# Altium schematic sheet 28Pins Schematic.SchDoc: 28Pins (part 2 of 3)
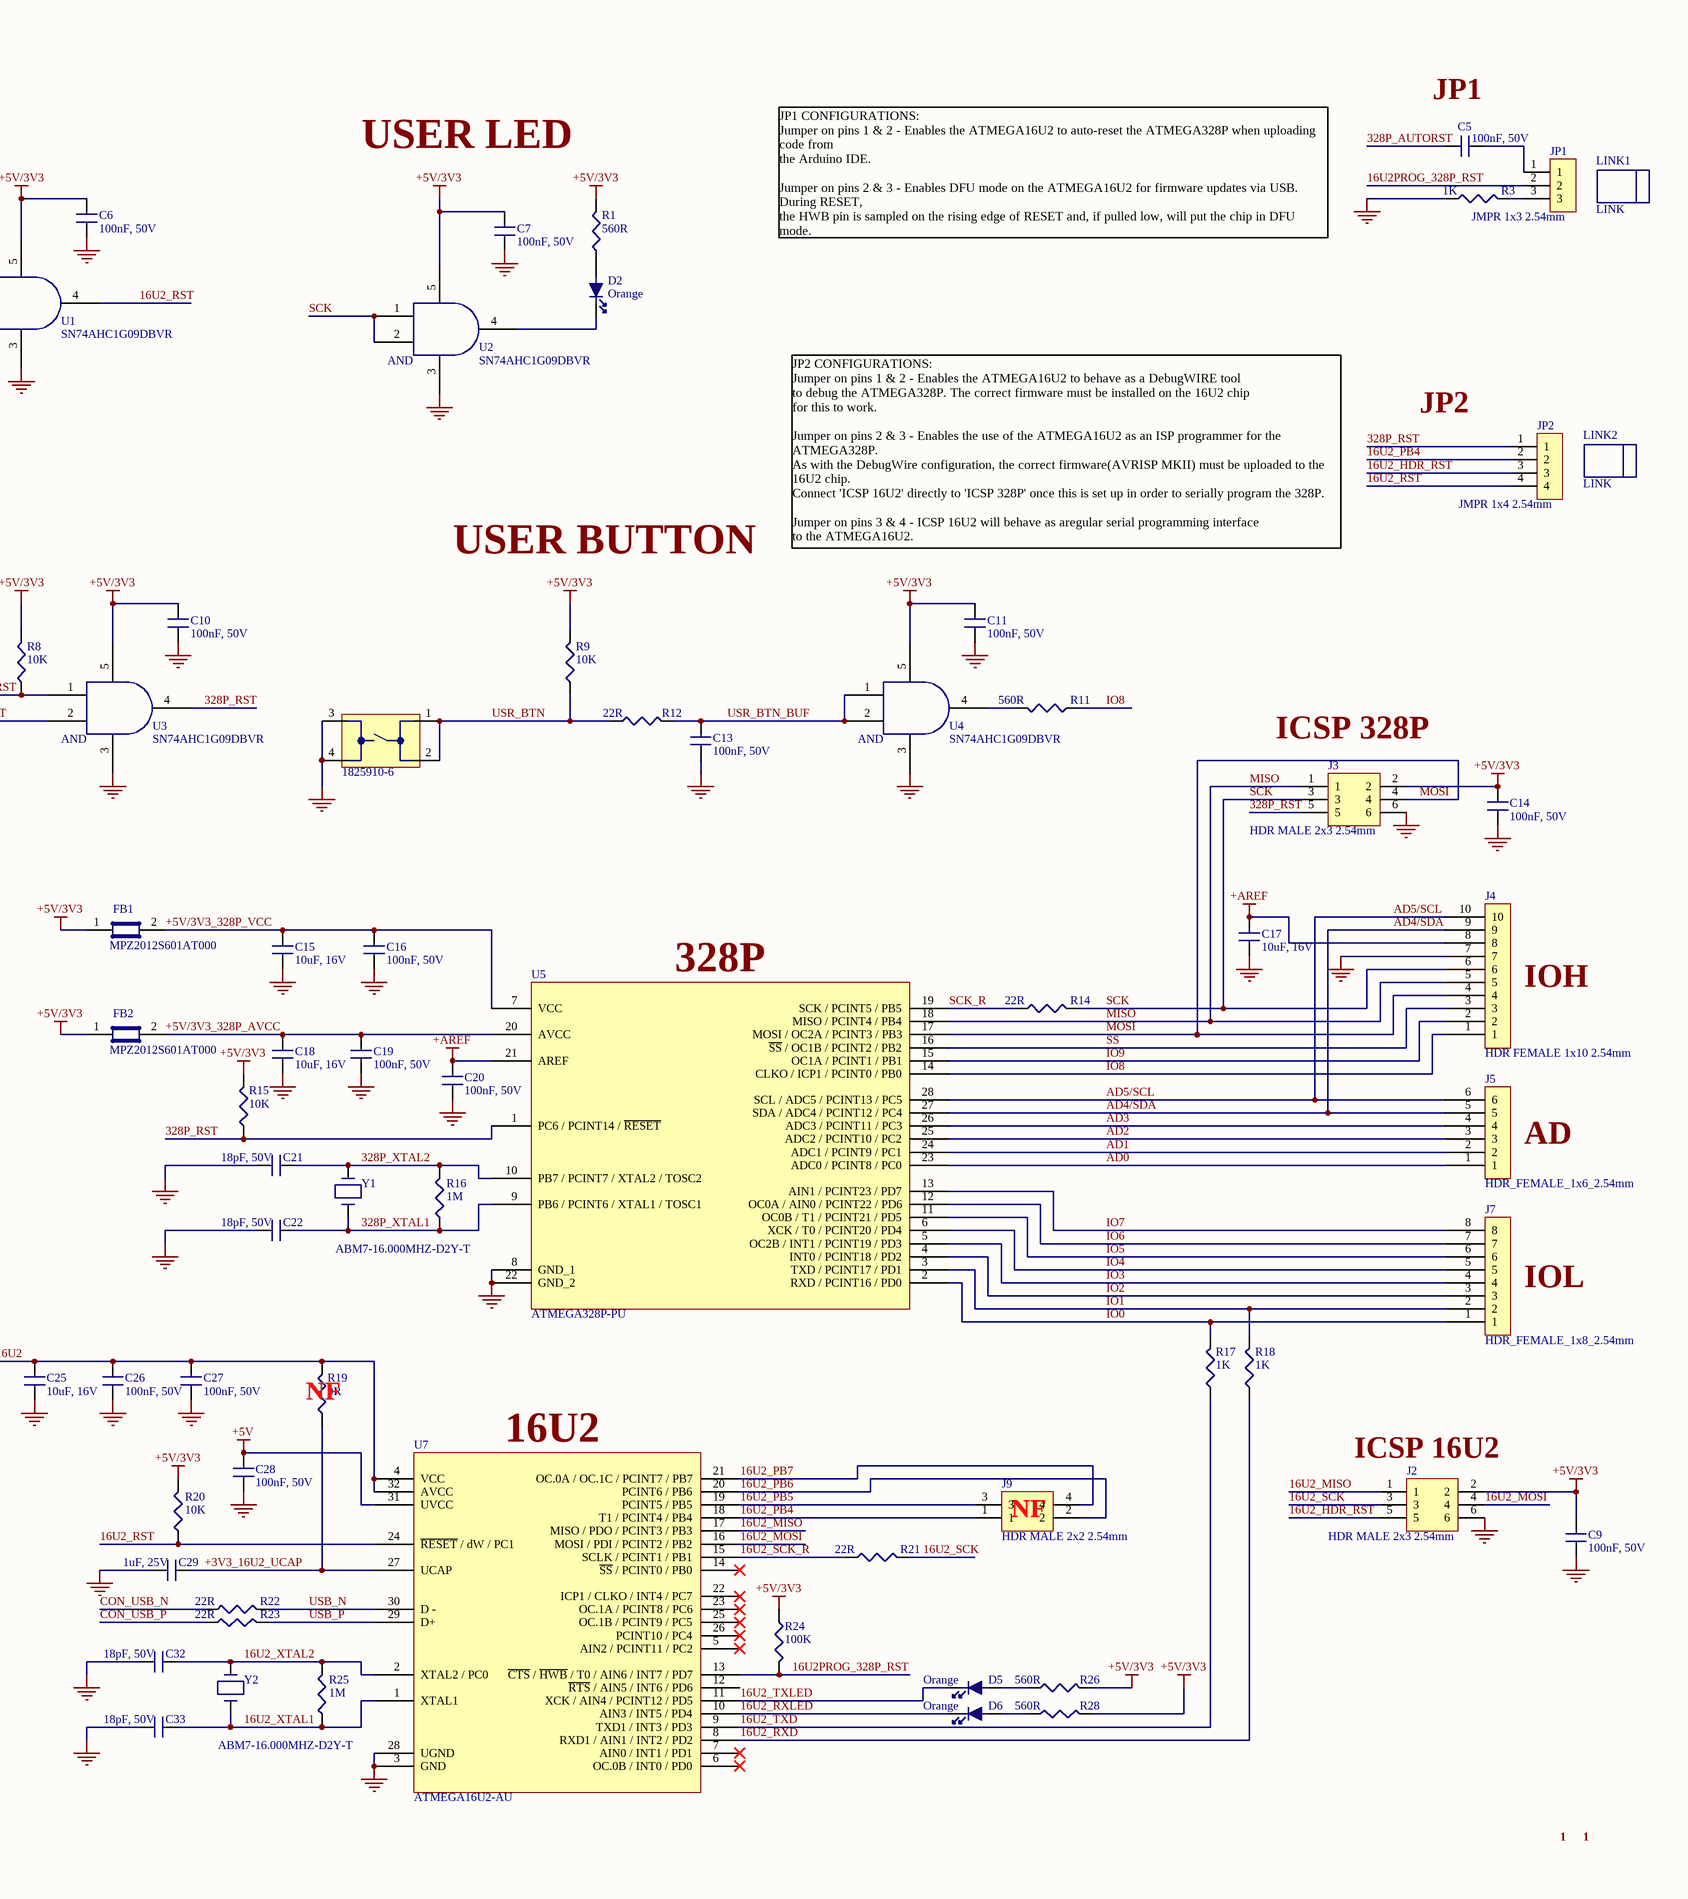
[diagram p2: 28Pins Schematic.SchDoc, right]
## Library data of the parts
C1-C3 C5-C14 C16 C19 C20 C26-C28 = C2012X7R1H104K085AA: TDK - C2012X7R1H104K085AA - Keramikvielschichtkondensator, SMD, 0.1 µF, 50 V, 0805 [Metrisch 2012], ± 10%, X7R, C Series TDK; PCN Part Number: MLCC Part Number Change 30/Nov/2012; Product Training Modules: C Series General Applications SEAT, CCV, and TVCL Design Tools Guide to Replacing an Electrolytic Capacitor with an MLCC; Capacitance: 0.1µF; Online Catalog: C Series, General Purpose; Kits: 445-9015-KIT-ND  - KIT MLCC 1000PF-47UF 0805 10-50V; Other Names: 445-7534-1; Supplier 1: Digi-Key; Manufacturer: TDK; Manufacturer Part Number: C2012X7R1H104K085AA; Stock 1: 148807; Pricing 1: 1=0.17, 10=0.119, 100=0.0561, 500=0.0394, 1000=0.0326 (USD); RoHS Information: RoHS Certificate-MLCC; Standard Package: 1; Category: Capacitors; Family: Ceramic Capacitors; Series: C; Packaging: Cut Tape (CT); Tolerance: ±10%; Voltage - Rated: 50V; Temperature Coefficient: X7R; Mounting Type: Surface Mount, MLCC; Operating Temperature: -55°C ~ 125°C; Applications: General Purpose; Ratings: -; Package / Case: 0805 (2012 Metric); Size / Dimension: 0.079" L x 0.049" W (2.00mm x 1.25mm); Height - Seated (Max): -; Thickness (Max): 0.037" (0.95mm); Lead Spacing: -; Features: -; Lead Style: -; ComponentLink1URL: http://uk.rs-online.com/webdocs/1532/0900766b81532cd0.pdf?src-supplier=RSComponents; ComponentLink1Description: http://uk.rs-online.com/webdocs/1532/0900766b81532cd0.pdf?src-supplier=RSComponents; ComponentLink2URL: https://product.tdk.com/info/en/catalog/datasheets/mlcc_commercial_general_en.pdf?src-supplier=Digi-Key; ComponentLink2Description: https://product.tdk.com/info/en/catalog/datasheets/mlcc_commercial_general_en.pdf?src-supplier=Digi-Key; ComponentLink3URL: http://www.tdk.co.jp/tefe02/e412_c.pdf?src-supplier=Future+Electronics; ComponentLink3Description: http://www.tdk.co.jp/tefe02/e412_c.pdf?src-supplier=Future+Electronics; ComponentLink4URL: http://www.farnell.com/datasheets/1796654.pdf?src-supplier=Newark; ComponentLink4Description: http://www.farnell.com/datasheets/1796654.pdf?src-supplier=Newark; ComponentLink5URL: http://www.farnell.com/datasheets/1571323.pdf?src-supplier=Element14; ComponentLink5Description: http://www.farnell.com/datasheets/1571323.pdf?src-supplier=Element14; Supplier Part Number 1: 445-7534-1-ND
C4 C15 C17 C18 C23-C25 = CGA4J1X5R1C106M125AC: Automotive Grade MLCC, 0805, X5R, 16V, 10 F, 20%, 1.25mm; Manufacturer: TDK; PCN Part Number: MLCC Part Number Change 30/Nov/2012; Product Training Modules: CGA Series for Automotive Applications SEAT, CCV, and TVCL Design Tools Guide to Replacing an Electrolytic Capacitor with an MLCC; Featured Product: CGA Series MLCC Capacitors; EDA / CAD Models: Download from Accelerated Designs; Capacitance: 10µF; Online Catalog: CGA Series, Automotive General, Mid and High Voltage; Other Names: 445-12654-1; Supplier 1: Digi-Key; Manufacturer Part Number: CGA4J1X5R1C106M125AC; Stock 1: 6740; Pricing 1: 1=0.52, 10=0.362, 100=0.2174, 500=0.163, 1000=0.1377 (USD); RoHS Information: CGA Series, RoHS Cert of Compliance; Standard Package: 1; Category: Capacitors; Family: Ceramic Capacitors; Series: CGA; Packaging: Cut Tape (CT); Tolerance: ±20%; Voltage - Rated: 16V; Temperature Coefficient: X5R; Mounting Type: Surface Mount, MLCC; Operating Temperature: -55°C ~ 85°C; Applications: Automotive; Ratings: AEC-Q200; Package / Case: 0805 (2012 Metric); Size / Dimension: 0.079" L x 0.049" W (2.00mm x 1.25mm); Thickness (Max): 0.057" (1.45mm); ComponentLink1URL: https://product.tdk.com/info/en/catalog/datasheets/mlcc_automotive_general_en.pdf?src-supplier=Digi-Key; ComponentLink1Description: https://product.tdk.com/info/en/catalog/datasheets/mlcc_automotive_general_en.pdf?src-supplier=Digi-Key; ComponentLink2URL: https://product.tdk.com/info/en/documents/chara_sheet/CGA4J1X5R1C106M125AC.pdf?src-supplier=Digi-Key; ComponentLink2Description: https://product.tdk.com/info/en/documents/chara_sheet/CGA4J1X5R1C106M125AC.pdf?src-supplier=Digi-Key; ComponentLink3URL: http://product.tdk.com/capacitor/mlcc/detailed_information.php?lang=en&ref=jp&part_no=CGA4J1X5R1C106M125AC&src-supplier=Mouser; ComponentLink3Description: http://product.tdk.com/capacitor/mlcc/detailed_information.php?lang=en&ref=jp&part_no=CGA4J1X5R1C106M125AC&src-supplier=Mouser; ComponentLink4URL: http://product.tdk.com/en/catalog/datasheets/mlcc_automotive_general_en.pdf?src-supplier=Avnet; ComponentLink4Description: http://product.tdk.com/en/catalog/datasheets/mlcc_automotive_general_en.pdf?src-supplier=Avnet; Supplier Part Number 1: 445-12654-1-ND
C21 C22 C32 C33 = C0805C180J5GACTU: CAP CER 18PF 50V C0G/NP0 0805; Manufacturer: KEMET; Product Depth: 1.25 mm; Product Height: 0.78 mm; Product Length: 2 mm; Dielectric: C0G; Tolerance: 5 %; Voltage: 50 Vdc; Supplier 1: Digi-Key; Manufacturer Part Number: C0805C180J5GACTU; Stock 1: 16285; Pricing 1: 1=0.14, 10=0.1, 100=0.0468, 500=0.0328, 1000=0.0272 (USD); Category: Capacitor Ceramic Multilayer; Construction: Flat; Operating Temperature: -55 to 125 °C; Capacitance Value: 18 pF; Mounting: Surface Mount; Package/Case: 0805; ComponentLink1URL: http://www.farnell.com/datasheets/1769375.pdf?src-supplier=Element14; ComponentLink1Description: http://www.farnell.com/datasheets/1769375.pdf?src-supplier=Element14; ComponentLink2URL: https://www.verical.com/server-webapp/html/getDatasheet?partID=385668&src-supplier=Verical; ComponentLink2Description: https://www.verical.com/server-webapp/html/getDatasheet?partID=385668&src-supplier=Verical; ComponentLink3URL: https://www.verical.com/server-webapp/html/getDatasheet?partID=759702&src-supplier=Verical; ComponentLink3Description: https://www.verical.com/server-webapp/html/getDatasheet?partID=759702&src-supplier=Verical; Supplier Part Number 1: 399-1112-1-ND
C29 = CGA4J3X7R1E105K125AB: CAP CER 1UF 25V X7R 0805; Manufacturer: TDK; PCN Part Number: MLCC Part Number Change 30/Nov/2012; Product Training Modules: CGA Series for Automotive Applications SEAT, CCV, and TVCL Design Tools Guide to Replacing an Electrolytic Capacitor with an MLCC; Featured Product: CGA Series MLCC Capacitors; Capacitance: 1µF; Tolerance: ±10%; Online Catalog: CGA Series, Automotive General, Mid and High Voltage; Other Names: 445-5687-6; Supplier 1: Digi-Key; Manufacturer Part Number: CGA4J3X7R1E105K125AB; Stock 1: 9208; Pricing 1: 1=0.24, 10=0.163, 100=0.0826, 500=0.0565, 1000=0.05 (USD); RoHS Information: RoHS Certificate-MLCC; Standard Package: 1; Category: Capacitors; Family: Ceramic Capacitors; Series: CGA; Packaging: Digi-Reel®; Voltage - Rated: 25V; Temperature Coefficient: X7R; Mounting Type: Surface Mount, MLCC; Operating Temperature: -55°C ~ 125°C; Applications: Automotive; Ratings: AEC-Q200; Package / Case: 0805 (2012 Metric); Size / Dimension: 0.079" L x 0.049" W (2.00mm x 1.25mm); Height - Seated (Max): -; Thickness (Max): 0.057" (1.45mm); Lead Spacing: -; Features: -; Lead Style: -; ComponentLink1URL: http://www.mouser.com/ds/2/400/lcc_automotive_general_en-843974.pdf?src-supplier=Mouser; ComponentLink1Description: http://www.mouser.com/ds/2/400/lcc_automotive_general_en-843974.pdf?src-supplier=Mouser; Supplier Part Number 1: 445-5687-1-ND
C30 C31 = EEE-1AA101WR: Cap Aluminum 100uF 10V 20% (5 X 5.4mm) SMD 50mA 1000 hr 85°C T/R; Manufacturer: Panasonic; Capacitance: 100 µF; Lifetime@Temperature: 2000 Hrs @ 85°C; Type: Can; Supplier 1: Digi-Key; Manufacturer Part Number: EEE-1AA101WR; Stock 1: 100201; Pricing 1: 1=0.32, 10=0.221, 100=0.1328, 500=0.0996 (USD); Case Size/Dimension: Ø 5 x 5.4 mm; Rated Voltage: 10 V; Operating Temp-Max: 85 °C; Operating Temp Range: -40 to +85 °C; Series: S; Ripple Current: 50 mA; ComponentLink1URL: https://industrial.panasonic.com/cdbs/www-data/pdf/RDE0000/DME0000COL90.pdf?src-supplier=Avnet; ComponentLink1Description: https://industrial.panasonic.com/cdbs/www-data/pdf/RDE0000/DME0000COL90.pdf?src-supplier=Avnet; ComponentLink2URL: https://industrial.panasonic.com/cdbs/www-data/pdf/RDE0000/DME0000COL90.pdf?src-supplier=Mouser; ComponentLink2Description: https://industrial.panasonic.com/cdbs/www-data/pdf/RDE0000/DME0000COL90.pdf?src-supplier=Mouser; ComponentLink3URL: http://industrial.panasonic.com/www-data/pdf/ABA0000/ABA0000CE2.pdf?src-supplier=Future+Electronics; ComponentLink3Description: http://industrial.panasonic.com/www-data/pdf/ABA0000/ABA0000CE2.pdf?src-supplier=Future+Electronics; ComponentLink4URL: https://industrial.panasonic.com/cdbs/www-data/pdf/RDE0000/DME0000COL90.pdf?src-supplier=Allied+Electronics; ComponentLink4Description: https://industrial.panasonic.com/cdbs/www-data/pdf/RDE0000/DME0000COL90.pdf?src-supplier=Allied+Electronics; ComponentLink5URL: https://industrial.panasonic.com/cdbs/www-data/pdf/RDE0000/DME0000COL90.pdf?src-supplier=Verical; ComponentLink5Description: https://industrial.panasonic.com/cdbs/www-data/pdf/RDE0000/DME0000COL90.pdf?src-supplier=Verical; Supplier Part Number 1: PCE3867CT-ND
D1 D3 = NSVBAT54HT1G: Schottky Diodes & Rectifiers SS SCHOTTKY DIODE; Manufacturer: ON Semiconductor; Voltage - DC Reverse (Vr) (Max): 30V; Current - Average Rectified (Io): 200mA (DC); Voltage - Forward (Vf) (Max) @ If: 800mV @ 100mA; Speed: Small Signal =; Reverse Recovery Time (trr): 5ns; Current - Reverse Leakage @ Vr: 2µA @ 25V; Capacitance @ Vr, F: 10pF @ 1V, 1MHz; Supplier 1: Digi-Key; Manufacturer Part Number: NSVBAT54HT1G; Stock 1: 10770; Pricing 1: 1=0.48, 10=0.362, 25=0.3268, 100=0.1723, 250=0.1705, 500=0.1527, 1000=0.1188 (USD); Standard Package: 3,000; Category: Discrete Semiconductor Products; Family: Diodes, Rectifiers - Single; Diode Type: Schottky; Mounting Type: Surface Mount; Package / Case: SC-76, SOD-323; Supplier Device Package: SOD-323; Packaging: Tape & Reel (TR); ComponentLink1URL: http://www.onsemi.com/pub/Collateral/BAT54HT1-D.PDF?src-supplier=Digi-Key; ComponentLink1Description: http://www.onsemi.com/pub/Collateral/BAT54HT1-D.PDF?src-supplier=Digi-Key; ComponentLink2URL: http://www.onsemi.com/pub_link/Collateral/BAT54HT1-D.PDF?src-supplier=Avnet+Europe; ComponentLink2Description: http://www.onsemi.com/pub_link/Collateral/BAT54HT1-D.PDF?src-supplier=Avnet+Europe; Supplier Part Number 1: NSVBAT54HT1GOSCT-ND
D2 D5 D6 = LOL29K-H2K1-24-Z: OSRAM - LO L29K-H2K1-24-Z - SMARTLED 0603 ORANGE; Manufacturer: Osram Opto; Categories: Optoelectronics; Configuration: Standard; Lens Color: White; Lens Transparency: Diffused; Millicandela Rating: 6.3mcd; Lens Style: Rectangle with Flat Top; Lens Size: 1.30mm x 0.80mm; Voltage - Forward (Vf) (Typ): 1.8V; Current - Test: 2mA; Viewing Angle: 160°; Wavelength - Dominant: 606nm; Wavelength - Peak: 610nm; Supplier 1: Digi-Key; Manufacturer Part Number: LOL29K-H2K1-24-Z; Stock 1: 0; Series: SmartLED; Packaging: Digi-Reel®; Part Status: Active; Color: Orange; Mounting Type: Surface Mount; Features: -; Package / Case: 0603 (1608 Metric); Supplier Device Package: 0603; Size / Dimension: 1.70mm L x 0.80mm W; Height (Max): 0.65mm; ComponentLink1URL: https://dammedia.osram.info/media/resource/hires/osram-dam-2493882/LO%20L29K.pdf?src-supplier=Digi-Key; ComponentLink1Description: https://dammedia.osram.info/media/resource/hires/osram-dam-2493882/LO%20L29K.pdf?src-supplier=Digi-Key; ComponentLink2URL: https://www.verical.com/server-webapp/html/getDatasheet?partID=693885&src-supplier=Verical; ComponentLink2Description: https://www.verical.com/server-webapp/html/getDatasheet?partID=693885&src-supplier=Verical; Supplier Part Number 1: 475-2740-2-ND
D4 = LGL29K-F2J1-24-Z: LED Uni-Color Green 572nm Automotive 2-Pin Chip 0603(1608Metric) T/R; Manufacturer: Osram Opto; Categories: Optoelectronics; Configuration: Standard; Lens Color: White; Lens Transparency: Diffused; Millicandela Rating: 3.5mcd; Lens Style: Rectangle with Flat Top; Lens Size: 1.30mm x 0.80mm; Voltage - Forward (Vf) (Typ): 1.7V; Current - Test: 2mA; Viewing Angle: 160°; Wavelength - Dominant: 570nm; Supplier 1: Digi-Key; Manufacturer Part Number: LGL29K-F2J1-24-Z; Stock 1: 0; Series: SmartLED; Packaging: Digi-Reel®; Part Status: Active; Color: Green; Mounting Type: Surface Mount; Wavelength - Peak: 572nm; Features: -; Package / Case: 0603 (1608 Metric); Supplier Device Package: 0603; Size / Dimension: 1.70mm L x 0.80mm W; Height (Max): 0.65mm; ComponentLink1URL: http://catalog.osram-os.com/catalogue/catalogue.do;jsessionid=3DE84243E85F820603DAFD5199D8DDA3?act=downloadFile&favOid=020000020000138e000100b6&src-supplier=Avnet; ComponentLink1Description: http://catalog.osram-os.com/catalogue/catalogue.do;jsessionid=3DE84243E85F820603DAFD5199D8DDA3?act=downloadFile&favOid=020000020000138e000100b6&src-supplier=Avnet; ComponentLink2URL: http://components.arrow.com/part/dataview/41971649S9781339N2128?src-supplier=Arrow; ComponentLink2Description: http://components.arrow.com/part/dataview/41971649S9781339N2128?src-supplier=Arrow; ComponentLink3URL: http://components.arrow.com/part/dataview/0323_02006818?src-supplier=Arrow+Europe; ComponentLink3Description: http://components.arrow.com/part/dataview/0323_02006818?src-supplier=Arrow+Europe; ComponentLink4URL: https://dammedia.osram.info/media/resource/hires/osram-dam-2493945/LG%20L29K.pdf?src-supplier=Digi-Key; ComponentLink4Description: https://dammedia.osram.info/media/resource/hires/osram-dam-2493945/LG%20L29K.pdf?src-supplier=Digi-Key; ComponentLink5URL: http://catalog.osram-os.com/catalogue/catalogue.do;jsessionid=3DE84243E85F820603DAFD5199D8DDA3?act=downloadFile&favOid=020000020000138e000100b6&src-supplier=Avnet+Europe; ComponentLink5Description: http://catalog.osram-os.com/catalogue/catalogue.do;jsessionid=3DE84243E85F820603DAFD5199D8DDA3?act=downloadFile&favOid=020000020000138e000100b6&src-supplier=Avnet+Europe; Supplier Part Number 1: 475-3118-1-ND
FB1-FB3 = MPZ2012S601AT000: FERRITE BEAD 600 OHM 0805 1LN; Manufacturer: TDK; PCN Part Number: MMZ,MPS Series Oct/2014; Product Training Modules: EMC Components; Catalog Drawings: (MMZ,MPZ)2012 Series Top / (MMZ,MPZ)2012 Series Footprint / (MMZ,MPZ)2012 Series Side; Impedance @ Frequency: 600 Ohm @ 100MHz; Current Rating: 2A; DC Resistance (DCR): 100 mOhm Max; Filter Type: Differential Mode - Single; Online Catalog: MPZ2012 Series; Other Names: 445-2206-6; Supplier 1: Digi-Key; Manufacturer Part Number: MPZ2012S601AT000; Stock 1: 137805; Pricing 1: 1=0.11, 10=0.091, 25=0.0704, 50=0.0584, 100=0.0503, 250=0.0403, 500=0.0362, 1000=0.0302 (USD); Standard Package: 1; Category: Filters; Family: Ferrite Beads and Chips; Series: MPZ; Packaging: Digi-Reel®; Package / Case: 0805 (2012 Metric); Mounting Type: Surface Mount; Height (Max): 0.041" (1.05mm); Size / Dimension: 0.079" L x 0.049" W (2.00mm x 1.25mm); ComponentLink1URL: https://media.digikey.com/pdf/Data%20Sheets/TDK%20PDFs/MPZ_Series_Br.pdf?src-supplier=Digi-Key; ComponentLink1Description: https://media.digikey.com/pdf/Data%20Sheets/TDK%20PDFs/MPZ_Series_Br.pdf?src-supplier=Digi-Key; ComponentLink2URL: https://product.tdk.com/info/en/catalog/datasheets/beads_commercial_power_mpz2012_en.pdf?src-supplier=Digi-Key; ComponentLink2Description: https://product.tdk.com/info/en/catalog/datasheets/beads_commercial_power_mpz2012_en.pdf?src-supplier=Digi-Key; Supplier Part Number 1: 445-2206-1-ND
FID1-FID4 = FID_1MM: Fiducial 40mil diameter, 120mil mask
J1 J7 = M20-7820842: 2.54mm (0.1") Pitch SIL Vertical PC Tail Socket Assembly, selective gold + tin, 8 contacts; Manufacturer: Harwin; Rad Hard: No; Number of Contacts: 8; Gender: SKT; Supplier 1: Digi-Key; Manufacturer Part Number: M20-7820842; Stock 1: 0; Pricing 1: 1=1.1, 10=0.972, 100=0.8382, 500=0.6858, 1000=0.6096, 5000=0.5334, 10000=0.5067 (USD); Type: Socket Strip; Pitch: 2.54 mm; Number of Rows: 1; Contact Plating: Gold; Termination Method: Solder; Category: Connector Headers and PCB Receptacles; ComponentLink1URL: https://cdn.harwin.com/pdfs/Harwin_PC_Connectors_M20.pdf?src-supplier=Avnet+Europe; ComponentLink1Description: https://cdn.harwin.com/pdfs/Harwin_PC_Connectors_M20.pdf?src-supplier=Avnet+Europe; ComponentLink2URL: http://www.harwin.com/include/downloads/drawings/M20-782.PDF?src-supplier=Avnet; ComponentLink2Description: http://www.harwin.com/include/downloads/drawings/M20-782.PDF?src-supplier=Avnet; Supplier Part Number 1: 952-1823-ND
J2 J3 = 67997-206HLF: CONN HEADER VERT 6POS 2.54MM; Manufacturer: Amphenol FCI; Number of Positions / Contacts: 6; Brand: FCI; Mounting Angle: Vertical; Current Rating: 3 A; Insulation Resistance: 5000 MOhms; Mating Post Length: 5.84 mm; Voltage Rating: 1.5 kV; Supplier 1: Digi-Key; Manufacturer Part Number: 67997-206HLF; Stock 1: 14300; Pricing 1: 1=0.33, 10=0.316, 100=0.2212, 500=0.1896, 1000=0.158, 5000=0.1355, 10000=0.1264 (USD); Mounting Style: Through Hole; Product Category: Headers & Wire Housings; RoHS: Details; Series: 67997; Product Type: Headers; Type: Unshrouded; Pitch: 2.54 mm; Number of Positions: 6; Number of Rows: 2; Contact Gender: Pin (Male); Contact Plating: Gold/GTX; Housing Material: Thermoplastic; Termination Style: Through Hole; Contact Material: Phosphor Bronze; Flammability Rating: UL 94 V-0; Operating Temperature Range: - 65 C to + 125 C; Packaging: Bulk; Factory Pack Quantity: 100; Termination Post Length: 3.05 mm; ComponentLink1URL: http://portal.fciconnect.com/Comergent/adirect/fci?cmd=catCustomerDrawing&productName=67997-206HLF&src-supplier=Mouser; ComponentLink1Description: http://portal.fciconnect.com/Comergent/adirect/fci?cmd=catCustomerDrawing&productName=67997-206HLF&src-supplier=Mouser; ComponentLink2URL: http://portal.fciconnect.com/Comergent/fci/drawing/67996.pdf?src-supplier=Avnet; ComponentLink2Description: http://portal.fciconnect.com/Comergent/fci/drawing/67996.pdf?src-supplier=Avnet; ComponentLink3URL: https://cdn.amphenol-icc.com/media/wysiwyg/files/drawing/67996.pdf?src-supplier=Digi-Key; ComponentLink3Description: https://cdn.amphenol-icc.com/media/wysiwyg/files/drawing/67996.pdf?src-supplier=Digi-Key; Supplier Part Number 1: 609-3234-ND
J4 = M20-7821046: HARWIN - M20-7821046 - Board-To-Board Connector, M20 Series, Through Hole, Receptacle, 10, 2.54 mm, Tin Plated Contacts; Number of Contacts: 10; Body Orientation: Straight; Current Rating: 3A; Supplier 1: Digi-Key; Manufacturer: Harwin; Manufacturer Part Number: M20-7821046; Stock 1: 499; Pricing 1: 1=1.28, 10=1.122, 100=0.968, 500=0.792, 1000=0.704, 5000=0.616, 10000=0.5852 (USD); Number of Rows: 1; Pitch: 2.54mm; Type: Socket Strip; Mounting Type: Through Hole; Termination Method: Solder; Contact Material: Phosphor Bronze; ComponentLink1URL: https://www.verical.com/server-webapp/html/getDatasheet?partID=559226&src-supplier=Verical; ComponentLink1Description: https://www.verical.com/server-webapp/html/getDatasheet?partID=559226&src-supplier=Verical; ComponentLink2URL: https://cdn.harwin.com/pdfs/M20-782.pdf?src-supplier=Digi-Key; ComponentLink2Description: https://cdn.harwin.com/pdfs/M20-782.pdf?src-supplier=Digi-Key; ComponentLink3URL: http://www.harwin.com/include/downloads/drawings/M20-782.PDF?src-supplier=Avnet; ComponentLink3Description: http://www.harwin.com/include/downloads/drawings/M20-782.PDF?src-supplier=Avnet; ComponentLink4URL: https://cdn.harwin.com/pdfs/Harwin_PC_Connectors_M20.pdf?src-supplier=Avnet+Europe; ComponentLink4Description: https://cdn.harwin.com/pdfs/Harwin_PC_Connectors_M20.pdf?src-supplier=Avnet+Europe; ComponentLink5URL: http://uk.rs-online.com/webdocs/1422/0900766b81422659.pdf?src-supplier=RSComponents; ComponentLink5Description: http://uk.rs-online.com/webdocs/1422/0900766b81422659.pdf?src-supplier=RSComponents; Supplier Part Number 1: 952-1847-ND
J5 = M20-7820642: Conn Socket Strip SKT 6 POS 2.54mm Solder ST Thru-Hole Tube; Manufacturer: Harwin; Number of Contacts: 6; Supplier 1: Digi-Key; Manufacturer Part Number: M20-7820642; Stock 1: 1120; Pricing 1: 1=0.99, 10=0.87, 100=0.7502, 500=0.6138, 1000=0.5456, 5000=0.4774, 10000=0.4535 (USD); Type: Socket Strip; Pitch: 2.54 mm; Number of Rows: 1; Gender: SKT; Contact Plating: Gold; Termination Method: Solder; Category: Connector Headers and PCB Receptacles; ComponentLink1URL: http://www.mouser.com/ds/2/181/Harwin_Product_Catalog_page_197-1134272.pdf?src-supplier=Mouser; ComponentLink1Description: http://www.mouser.com/ds/2/181/Harwin_Product_Catalog_page_197-1134272.pdf?src-supplier=Mouser; ComponentLink2URL: https://cdn.harwin.com/pdfs/M20-782.pdf?src-supplier=Digi-Key; ComponentLink2Description: https://cdn.harwin.com/pdfs/M20-782.pdf?src-supplier=Digi-Key; ComponentLink3URL: http://www.harwin.com/include/downloads/pdfs/60PAGE140.PDF?src-supplier=Avnet; ComponentLink3Description: http://www.harwin.com/include/downloads/pdfs/60PAGE140.PDF?src-supplier=Avnet; ComponentLink4URL: http://components.arrow.com/part/dataview/0323_00725895?src-supplier=Arrow+Europe; ComponentLink4Description: http://components.arrow.com/part/dataview/0323_00725895?src-supplier=Arrow+Europe; Supplier Part Number 1: 952-1808-ND
J6 J8 = PAD_WITH_HOLE_4MMx1.5MM
J9 = 68602-204HLF: CONN HEADER VERT 4POS 2.54MM; Manufacturer: Amphenol FCI; Rad Hard: No; Number of Contacts: 4; Supplier 1: Digi-Key; Manufacturer Part Number: 68602-204HLF; Stock 1: 655; Pricing 1: 1=0.34, 10=0.319, 100=0.2232, 500=0.1913, 1000=0.1594, 5000=0.1367, 10000=0.1275 (USD); Packaging: Bulk; Type: Unshrouded Header; Pitch: 2.54 mm; Number of Rows: 2; Gender: HDR; Contact Plating: Gold Over Nickel|GXT Over Nickel; Termination Method: Solder; Category: Connector Headers and PCB Receptacles; ComponentLink1URL: https://cdn.amphenol-icc.com/media/wysiwyg/files/drawing/67996.pdf?src-supplier=Digi-Key; ComponentLink1Description: https://cdn.amphenol-icc.com/media/wysiwyg/files/drawing/67996.pdf?src-supplier=Digi-Key; Supplier Part Number 1: 609-3369-ND
J10 = 10118193-0001LF: CONN USB MICRO B RECPT SMT R/A; Manufacturer: Amphenol FCI; Number of Contacts: 5 Contact; Gender: Female; Current Rating: 1.8 A; Brand: FCI; Connector Type: Micro USB Type B receptacle; Insulation Resistance: 1000 MOhms; Mounting Angle: Right; Supplier 1: Digi-Key; Manufacturer Part Number: 10118193-0001LF; Stock 1: 50057; Pricing 1: 1=0.43, 10=0.405, 25=0.3648, 50=0.3242, 100=0.3107, 250=0.2837, 500=0.2702 (USD); Product Category: USB Connectors; RoHS: Details; Product: Micro USB Type B Connectors; Standard: USB 2.0; Termination Style: SMD/SMT; Color: Black; Contact Material: Copper Alloy; Contact Plating: Gold; Flammability Rating: UL 94 V-0; Operating Temperature Range: - 55 C to + 85 C; Packaging: Reel; Factory Pack Quantity: 1200; ComponentLink1URL: https://cdn.amphenol-icc.com/media/wysiwyg/files/documentation/datasheet/inputoutput/io_usb_micro.pdf?src-supplier=Digi-Key; ComponentLink1Description: https://cdn.amphenol-icc.com/media/wysiwyg/files/documentation/datasheet/inputoutput/io_usb_micro.pdf?src-supplier=Digi-Key; ComponentLink2URL: https://cdn.amphenol-icc.com/media/wysiwyg/files/documentation/datasheet/inputoutput/io_usb_micro.pdf?src-supplier=Arrow; ComponentLink2Description: https://cdn.amphenol-icc.com/media/wysiwyg/files/documentation/datasheet/inputoutput/io_usb_micro.pdf?src-supplier=Arrow; ComponentLink3URL: http://www.amphenol-icc.com/media/wysiwyg/files/drawing/10118193.pdf?src-supplier=Digi-Key; ComponentLink3Description: http://www.amphenol-icc.com/media/wysiwyg/files/drawing/10118193.pdf?src-supplier=Digi-Key; ComponentLink4URL: https://cdn.amphenol-icc.com/media/wysiwyg/files/documentation/datasheet/inputoutput/io_usb_micro.pdf?src-supplier=Verical; ComponentLink4Description: https://cdn.amphenol-icc.com/media/wysiwyg/files/documentation/datasheet/inputoutput/io_usb_micro.pdf?src-supplier=Verical; ComponentLink5URL: https://cdn.amphenol-icc.com/media/wysiwyg/files/documentation/datasheet/inputoutput/io_usb_micro.pdf?src-supplier=Allied+Electronics; ComponentLink5Description: https://cdn.amphenol-icc.com/media/wysiwyg/files/documentation/datasheet/inputoutput/io_usb_micro.pdf?src-supplier=Allied+Electronics; ComponentLink6URL: https://cdn.amphenol-icc.com/media/wysiwyg/files/documentation/datasheet/inputoutput/io_usb_micro.pdf?src-supplier=Mouser; ComponentLink6Description: https://cdn.amphenol-icc.com/media/wysiwyg/files/documentation/datasheet/inputoutput/io_usb_micro.pdf?src-supplier=Mouser; Supplier Part Number 1: 609-4616-1-ND
JP1 JP3 = 68000-203HLF: CONN HEADER VERT 3POS 2.54MM; Manufacturer: Amphenol FCI; Brand: FCI; Current Rating: 3 A; Number of Positions / Contacts: 3; Mounting Angle: Vertical; Insulation Resistance: 5000 MOhms; Mating Post Length: 5.84 mm; Voltage Rating: 1.5 kV; Supplier 1: Digi-Key; Manufacturer Part Number: 68000-203HLF; Stock 1: 14338; Pricing 1: 1=0.28, 10=0.267, 100=0.1869, 500=0.1602, 1000=0.1335, 5000=0.1145, 10000=0.1068 (USD); Contact Gender: Pin (Male); Contact Plating: Gold; Contact Material: Phosphor Bronze; Factory Pack Quantity: 100; Mounting Style: Through Hole; Number of Positions: 3; Housing Material: Thermoplastic; Product Category: Headers & Wire Housings; RoHS: Details; Series: BergStik; Product Type: Headers; Type: Unshrouded; Pitch: 2.54 mm; Number of Rows: 1; Termination Style: Through Hole; Packaging: Bulk; Termination Post Length: 2.41 mm; ComponentLink1URL: http://www.mouser.com/ds/2/154/68000-50221.pdf?src-supplier=Mouser; ComponentLink1Description: http://www.mouser.com/ds/2/154/68000-50221.pdf?src-supplier=Mouser; ComponentLink2URL: http://www.farnell.com/datasheets/1914865.pdf?src-supplier=Element14; ComponentLink2Description: http://www.farnell.com/datasheets/1914865.pdf?src-supplier=Element14; ComponentLink3URL: http://portal.fciconnect.com/Comergent/fci/drawing/68000.pdf?src-supplier=Avnet+Europe; ComponentLink3Description: http://portal.fciconnect.com/Comergent/fci/drawing/68000.pdf?src-supplier=Avnet+Europe; ComponentLink4URL: https://cdn.amphenol-icc.com/media/wysiwyg/files/drawing/68000.pdf?src-supplier=Digi-Key; ComponentLink4Description: https://cdn.amphenol-icc.com/media/wysiwyg/files/drawing/68000.pdf?src-supplier=Digi-Key; ComponentLink5URL: http://portal.fciconnect.com/Comergent/fci/drawing/68000.pdf?src-supplier=Avnet; ComponentLink5Description: http://portal.fciconnect.com/Comergent/fci/drawing/68000.pdf?src-supplier=Avnet; Supplier Part Number 1: 609-3464-ND
JP2 = 68001-204HLF: CONN HEADER VERT 4POS 2.54MM; Manufacturer: Amphenol FCI; Rad Hard: No; Number of Contacts: 4; Gender: HDR; Supplier 1: Digi-Key; Manufacturer Part Number: 68001-204HLF; Stock 1: 3841; Pricing 1: 1=0.38, 10=0.357, 100=0.2501, 500=0.2144, 1000=0.1787, 5000=0.1532, 10000=0.1429 (USD); Packaging: Bulk; Type: Unshrouded Header; Pitch: 2.54 mm; Number of Rows: 1; Contact Plating: Gold Over Nickel|GXT Over Nickel; Termination Method: Solder; Category: Connector Headers and PCB Receptacles; ComponentLink1URL: https://cdn.amphenol-icc.com/media/wysiwyg/files/drawing/68000.pdf?src-supplier=Digi-Key; ComponentLink1Description: https://cdn.amphenol-icc.com/media/wysiwyg/files/drawing/68000.pdf?src-supplier=Digi-Key; ComponentLink2URL: https://cdn.amphenol-icc.com/media/wysiwyg/files/drawing/68000.pdf?src-supplier=Mouser; ComponentLink2Description: https://cdn.amphenol-icc.com/media/wysiwyg/files/drawing/68000.pdf?src-supplier=Mouser; Supplier Part Number 1: 609-3402-ND
L1 = L1210R2R2MDWIT: FIXED IND 2.2UH 2A 80 MOHM SMD; Manufacturer: KEMET; Type: Chip; Maximum DC Current: 1.13 A; Tolerance: 20 %; Maximum DC Resistance: 80(Typ) mOhm; Rad Hard: No; Product Depth: 2.7 mm; Supplier 1: Digi-Key; Manufacturer Part Number: L1210R2R2MDWIT; Stock 1: 17969; Pricing 1: 1=0.55, 10=0.479, 100=0.3421, 500=0.2874 (USD); Package/Case: 1210; Inductance: 2.2 uH; Product Height: 2.7 mm; ComponentLink1URL: https://content.kemet.com/datasheets/F3115.pdf?src-supplier=Mouser; ComponentLink1Description: https://content.kemet.com/datasheets/F3115.pdf?src-supplier=Mouser; ComponentLink2URL: https://content.kemet.com/datasheets/F3115.pdf?src-supplier=Avnet+Europe; ComponentLink2Description: https://content.kemet.com/datasheets/F3115.pdf?src-supplier=Avnet+Europe; ComponentLink3URL: http://www.farnell.com/datasheets/27262.pdf?src-supplier=Element14; ComponentLink3Description: http://www.farnell.com/datasheets/27262.pdf?src-supplier=Element14; ComponentLink4URL: https://api.kemet.com/component-edge/download/datasheet/L1210R2R2MDWIT.pdf?src-supplier=Digi-Key; ComponentLink4Description: https://api.kemet.com/component-edge/download/datasheet/L1210R2R2MDWIT.pdf?src-supplier=Digi-Key; ComponentLink5URL: http://www.kemet.com/Lists/ProductCatalog/Attachments/57/F3115.pdf?src-supplier=Avnet; ComponentLink5Description: http://www.kemet.com/Lists/ProductCatalog/Attachments/57/F3115.pdf?src-supplier=Avnet; Supplier Part Number 1: 399-9598-1-ND
LINK1-LINK3 = QPC02SXGN-RC: CONN JUMPER SHORTING .100" GOLD; Manufacturer: Sullins; Gender: Female Sockets; Number of Positions or Pins (Grid): 2 (1 x 2); Pitch: 0.100" (2.54mm); Dynamic Catalog: Shunts and Jumpers - Sullins Connector Solutions; Other Names: S9337; Supplier 1: Digi-Key; Manufacturer Part Number: QPC02SXGN-RC; Stock 1: 547968; Pricing 1: 1=0.1, 10=0.059, 25=0.044, 50=0.0378, 100=0.0365, 250=0.0315, 500=0.0302, 1000=0.0265, 2500=0.0239 (USD); Standard Package: 2,000; Category: Connectors, Interconnects; Family: Shunts, Jumpers; Type: Open Top; Height: 0.235" (5.97mm); Contact Finish: Gold; Contact Finish Thickness: Flash; Packaging: Bulk; ComponentLink1URL: https://s3.amazonaws.com/catalogspreads-pdf/PAGE128-129%20.100%20JUMPER.pdf?src-supplier=Digi-Key; ComponentLink1Description: https://s3.amazonaws.com/catalogspreads-pdf/PAGE128-129%20.100%20JUMPER.pdf?src-supplier=Digi-Key; Supplier Part Number 1: S9337-ND
MH1-MH3 = MH_7.4MMC_3.2MMD: Mounting hole 7.4mm diameter, 3.2mm drill
MH4 = MH_7.4MMNC_3: Mounting hole 7.4mm diameter (non copper) 3.2mm drill NPTH
R1 R11 R13 R26 R28 = RC0805FR-07560RL: Surface Mount Thick Film Resistor, RC Series, 560 ohm, 125 mW, - 1%, 150 V, 0805 [2012 Metric]; Manufacturer: Yageo; Resistance: 560 Ohms; Power Rating: 125 mW (1/8 W); Temperature Coefficient: 100 PPM / C; Voltage Rating: 150 V; Unit Weight: 0.000194 oz; Supplier 1: Digi-Key; Manufacturer Part Number: RC0805FR-07560RL; Stock 1: 290660; Pricing 1: 1=0.1, 10=0.04, 100=0.0163, 1000=0.0073, 2500=0.0064 (USD); Product Category: Thick Film Resistors; RoHS: True; Brand: Yageo; Tolerance: 1 %; Case Code - in: 0805; Case Code - mm: 2012; Operating Temperature Range: - 55 C to + 155 C; Series: RC; Height: 0.5 mm; Length: 2 mm; Package / Case: 0805 (2012 metric); Packaging: Reel; Product: Thick Film Resistors General Purpose; Termination Style: SMD/SMT; Type: General Purpose Chip Resistor Surface Mount; Width: 1.25 mm; ComponentLink1URL: http://www.yageo.com/documents/recent/PYu-RC_Group_51_RoHS_L_10.pdf?src-supplier=Digi-Key; ComponentLink1Description: http://www.yageo.com/documents/recent/PYu-RC_Group_51_RoHS_L_10.pdf?src-supplier=Digi-Key; ComponentLink2URL: http://www.yageo.com/documents/recent/PYu-RC_Group_51_RoHS_L_9.pdf?src-supplier=Mouser; ComponentLink2Description: http://www.yageo.com/documents/recent/PYu-RC_Group_51_RoHS_L_9.pdf?src-supplier=Mouser; ComponentLink3URL: http://www.farnell.com/datasheets/2167052.pdf?src-supplier=Element14; ComponentLink3Description: http://www.farnell.com/datasheets/2167052.pdf?src-supplier=Element14; Supplier Part Number 1: 311-560CRCT-ND
R2 R7-R9 R15 R20 = RC0805FR-0710KL: RES SMD 10K OHM 1% 1/8W 0805; Manufacturer: Yageo; Resistance: 10 kOhms; Power Rating: 125 mW (1/8 W); Voltage Rating: 150 V; Temperature Coefficient: 100 PPM / C; Supplier 1: Digi-Key; Manufacturer Part Number: RC0805FR-0710KL; Stock 1: 24193550; Pricing 1: 1=0.1, 10=0.04, 100=0.0163, 1000=0.0073, 2500=0.0064 (USD); Termination Style: SMD/SMT; Product: Thick Film Resistors General Purpose; Tolerance: 1 %; Case Code - in: 0805; Case Code - mm: 2012; Series: RC; Operating Temperature Range: - 55 C to + 155 C; Packaging: Reel; ComponentLink1URL: http://www.yageo.com/documents/recent/PYu-RC_Group_51_RoHS_L_9.pdf?src-supplier=Mouser; ComponentLink1Description: http://www.yageo.com/documents/recent/PYu-RC_Group_51_RoHS_L_9.pdf?src-supplier=Mouser; ComponentLink2URL: http://www.farnell.com/datasheets/2167052.pdf?src-supplier=Element14; ComponentLink2Description: http://www.farnell.com/datasheets/2167052.pdf?src-supplier=Element14; ComponentLink3URL: http://www.yageo.com/documents/recent/PYu-RC_Group_51_RoHS_L_10.pdf?src-supplier=Digi-Key; ComponentLink3Description: http://www.yageo.com/documents/recent/PYu-RC_Group_51_RoHS_L_10.pdf?src-supplier=Digi-Key; ComponentLink4URL: http://www.yageo.ru/pdf/RC0805.pdf?src-supplier=Future+Electronics; ComponentLink4Description: http://www.yageo.ru/pdf/RC0805.pdf?src-supplier=Future+Electronics; Supplier Part Number 1: 311-10.0KCRCT-ND
R3 R17 R18 = RC0805FR-071KL: RESISTOR, 0805 1K 1%, FULL REEL; Product Range:YAGEO - RC Series; Resistance:1kohm; Power Rating:125mW; Resistance Tolerance:± 1%; Resistor Case Style:0805 [2012 Metric]; Resistor Element Material:Thick Film; Temperature Coefficient:± 250ppm/°C; Voltage Rating:150V; Packaging:Tape & Reel; MSL:-; SVHC:No SVHC (16-Dec-2013); External Depth:0.55mm; External Length / Height:2mm; External Width:1.25mm; No. of Pins:2; Operating Temperature Max:155°C; Operating Temperature Min:-55°C; Operating Temperature Range:-55°C to +155°C; Reel Quantity:5000; Resistor Mounting:SMD; Series:RC12H; Temperature Coef; Manufacturer: Yageo; Resistance: 1 kOhms; Power Rating: 125 mW (1/8 W); Voltage Rating: 150 V; Temperature Coefficient: 100 PPM / C; Supplier 1: Digi-Key; Manufacturer Part Number: RC0805FR-071KL; Stock 1: 21029756; Pricing 1: 1=0.1, 10=0.04, 100=0.0163, 1000=0.0073, 2500=0.0064 (USD); Termination Style: SMD/SMT; Product: Thick Film Resistors General Purpose; Tolerance: 1 %; Case Code - in: 0805; Case Code - mm: 2012; Series: RC; Operating Temperature Range: - 55 C to + 155 C; Packaging: Reel; ComponentLink1URL: http://www.yageo.com/documents/recent/PYu-RC_Group_51_RoHS_L_10.pdf?src-supplier=Digi-Key; ComponentLink1Description: http://www.yageo.com/documents/recent/PYu-RC_Group_51_RoHS_L_10.pdf?src-supplier=Digi-Key; ComponentLink2URL: http://www.farnell.com/datasheets/1686128.pdf?src-supplier=Element14; ComponentLink2Description: http://www.farnell.com/datasheets/1686128.pdf?src-supplier=Element14; ComponentLink3URL: http://www.yageo.ru/pdf/RC0805.pdf?src-supplier=Future+Electronics; ComponentLink3Description: http://www.yageo.ru/pdf/RC0805.pdf?src-supplier=Future+Electronics; ComponentLink4URL: http://www.farnell.com/datasheets/2167052.pdf?src-supplier=Element14; ComponentLink4Description: http://www.farnell.com/datasheets/2167052.pdf?src-supplier=Element14; Supplier Part Number 1: 311-1.00KCRCT-ND
R4 R10 R12 R14 R21-R23 = AC0805FR-0722RL: RES SMD 22 OHM 1% 1/8W 0805; Manufacturer: Yageo; Resistance: 22 Ohms; Power Rating: 125 mW (1/8 W); Temperature Coefficient: 100 PPM / C; Voltage Rating: 150 V; Unit Weight: 0.000194 oz; Supplier 1: Digi-Key; Manufacturer Part Number: AC0805FR-0722RL; Stock 1: 1095; Pricing 1: 1=0.1, 10=0.048, 100=0.0197, 1000=0.0089, 2500=0.0077 (USD); Product Category: Thick Film Resistors; RoHS: True; Tolerance: 1 %; Case Code - in: 0805; Case Code - mm: 2012; Operating Temperature Range: - 55 C to + 155 C; Series: AC; Brand: Yageo; Height: 0.5 mm; Length: 2 mm; Package / Case: 0805 (2012 metric); Packaging: Reel; Product: Thick Film Resistors SMD; Termination Style: SMD/SMT; Type: Chip Resistor Surface Mount; Width: 1.25 mm; ComponentLink1URL: http://www.yageo.com/NewPortal/yageodocoutput?fileName=/pdf/R-Chip/PYu-AC_51_RoHS_L_6.pdf&src-supplier=Mouser; ComponentLink1Description: http://www.yageo.com/NewPortal/yageodocoutput?fileName=/pdf/R-Chip/PYu-AC_51_RoHS_L_6.pdf&src-supplier=Mouser; Supplier Part Number 1: YAG3713CT-ND
R5 R6 R19 R27 = RC0805JR-070RL: Surface Mount Thick Film Resistor, RC Series, 125 mW, - 5%, 150 V, 0805 [2012 Metric]; Manufacturer: Yageo; Voltage Rating: 150 V; Temperature Coefficient: 200 PPM / C; Power Rating: 125 mW (1/8 W); Resistance: 0 Ohms; Supplier 1: Digi-Key; Manufacturer Part Number: RC0805JR-070RL; Stock 1: 9439861; Pricing 1: 1=0.1, 10=0.035, 25=0.0248, 50=0.019, 100=0.014, 250=0.0107, 500=0.0086, 1000=0.0063 (USD); Tolerance: 5 %; Termination Style: SMD/SMT; Product: Thick Film Resistors Zero-Ohm; Case Code - in: 0805; Case Code - mm: 2012; Series: RC; Operating Temperature Range: - 55 C to + 155 C; Packaging: Reel; ComponentLink1URL: http://www.farnell.com/datasheets/2167052.pdf?src-supplier=Element14; ComponentLink1Description: http://www.farnell.com/datasheets/2167052.pdf?src-supplier=Element14; ComponentLink2URL: http://documents.rs-components.com/techlib://itc_doclist_GB.htm?stockno=6185129&src-supplier=RSComponents; ComponentLink2Description: http://documents.rs-components.com/techlib://itc_doclist_GB.htm?stockno=6185129&src-supplier=RSComponents; ComponentLink3URL: https://www.verical.com/server-webapp/html/getDatasheet?partID=330685&src-supplier=Verical; ComponentLink3Description: https://www.verical.com/server-webapp/html/getDatasheet?partID=330685&src-supplier=Verical; Supplier Part Number 1: 311-0.0ARCT-ND
R16 R25 = RC0805FR-071ML: RES SMD 1M OHM 1% 1/8W 0805; Manufacturer: Yageo; Resistance: 1 MOhms; Power Rating: 125 mW (1/8 W); Voltage Rating: 150 V; Temperature Coefficient: 100 PPM / C; Supplier 1: Digi-Key; Manufacturer Part Number: RC0805FR-071ML; Stock 1: 3833692; Pricing 1: 1=0.1, 10=0.04, 100=0.0163, 1000=0.0073, 2500=0.0064 (USD); Termination Style: SMD/SMT; Product: Thick Film Resistors General Purpose; Tolerance: 1 %; Case Code - in: 0805; Case Code - mm: 2012; Series: RC; Operating Temperature Range: - 55 C to + 155 C; Packaging: Reel; ComponentLink1URL: http://www.yageo.com/documents/recent/PYu-RC_Group_51_RoHS_L_10.pdf?src-supplier=Digi-Key; ComponentLink1Description: http://www.yageo.com/documents/recent/PYu-RC_Group_51_RoHS_L_10.pdf?src-supplier=Digi-Key; ComponentLink2URL: http://www.yageo.ru/pdf/RC0805.pdf?src-supplier=Future+Electronics; ComponentLink2Description: http://www.yageo.ru/pdf/RC0805.pdf?src-supplier=Future+Electronics; ComponentLink3URL: http://www.yageo.com/documents/recent/PYu-RC_Group_51_RoHS_L_9.pdf?src-supplier=Mouser; ComponentLink3Description: http://www.yageo.com/documents/recent/PYu-RC_Group_51_RoHS_L_9.pdf?src-supplier=Mouser; Supplier Part Number 1: 311-1.00MCRCT-ND
R24 = RC0805FR-07100KL: YAGEO         RC0805FR-07100KL            RES, THICK FILM, 100K, 1%, 0.125W, 0805, REEL; Resistance: 100 kOhms; Power Rating: 125 mW (1/8 W); Voltage Rating: 150 V; Temperature Coefficient: 100 PPM / C; Supplier 1: Digi-Key; Manufacturer: Yageo; Manufacturer Part Number: RC0805FR-07100KL; Stock 1: 5277424; Pricing 1: 1=0.1, 10=0.04, 100=0.0163, 1000=0.0073, 2500=0.0064 (USD); Termination Style: SMD/SMT; Product: Thick Film Resistors General Purpose; Tolerance: 1 %; Case Code - in: 0805; Case Code - mm: 2012; Series: RC; Operating Temperature Range: - 55 C to + 155 C; Packaging: Reel; ComponentLink1URL: http://www.yageo.com/documents/recent/PYu-RC_Group_51_RoHS_L_10.pdf?src-supplier=Digi-Key; ComponentLink1Description: http://www.yageo.com/documents/recent/PYu-RC_Group_51_RoHS_L_10.pdf?src-supplier=Digi-Key; ComponentLink2URL: http://www.yageo.com/documents/recent/PYu-RC_Group_51_RoHS_L_9.pdf?src-supplier=Mouser; ComponentLink2Description: http://www.yageo.com/documents/recent/PYu-RC_Group_51_RoHS_L_9.pdf?src-supplier=Mouser; ComponentLink3URL: http://documents.rs-components.com/techlib://itc_doclist_GB.htm?stockno=6185113&src-supplier=RSComponents; ComponentLink3Description: http://documents.rs-components.com/techlib://itc_doclist_GB.htm?stockno=6185113&src-supplier=RSComponents; ComponentLink4URL: http://www.yageo.ru/pdf/RC0805.pdf?src-supplier=Future+Electronics; ComponentLink4Description: http://www.yageo.ru/pdf/RC0805.pdf?src-supplier=Future+Electronics; ComponentLink5URL: http://www.farnell.com/datasheets/38627.pdf?src-supplier=Element14; ComponentLink5Description: http://www.farnell.com/datasheets/38627.pdf?src-supplier=Element14; ComponentLink6URL: http://www.farnell.com/datasheets/2167052.pdf?src-supplier=Element14; ComponentLink6Description: http://www.farnell.com/datasheets/2167052.pdf?src-supplier=Element14; ComponentLink7URL: http://www.farnell.com/datasheets/1686128.pdf?src-supplier=Element14; ComponentLink7Description: http://www.farnell.com/datasheets/1686128.pdf?src-supplier=Element14; ComponentLink8URL: http://www.farnell.com/datasheets/444164.pdf?src-supplier=Element14; ComponentLink8Description: http://www.farnell.com/datasheets/444164.pdf?src-supplier=Element14; Supplier Part Number 1: 311-100KCRDKR-ND
SCKT1 = 4828-3004-CP: CONN IC DIP SOCKET 28POS TIN; Manufacturer: 3M; Part # Aliases: 05111116010 80000917973; Brand: 3M Electronic Solutions Division; Insulation Resistance: 5000 MOhms; Number of Positions / Contacts: 28; Pitch: 2.54 mm; Supplier 1: Digi-Key; Manufacturer Part Number: 4828-3004-CP; Stock 1: 5236; Pricing 1: 1=0.79, 10=0.693, 25=0.6524, 50=0.6254, 100=0.5982, 250=0.5438, 500=0.4894, 1000=0.435, 2500=0.3943 (USD); Contact Plating: Tin; Mounting Style: Through Hole; Factory Pack Quantity: 5600; Product Category: .100" Wire Mount Connectors; Product: DIP / SIP Sockets; Number of Rows: 2; Number of Positions: 28; Operating Temperature Range: - 25 C to + 85 C; RoHS: Details; Termination Style: Solder Tail; Socket / Case Type: DIP; ComponentLink1URL: http://multimedia.3m.com/mws/media/218496O/3mtm-dip-socket-4800-series-ts1099.pdf?src-supplier=Digi-Key; ComponentLink1Description: http://multimedia.3m.com/mws/media/218496O/3mtm-dip-socket-4800-series-ts1099.pdf?src-supplier=Digi-Key; Supplier Part Number 1: 3M5480-ND
SW1 SW2 = 1825910-6: ALCOSWITCH - TE CONNECTIVITY - 1825910-6 - Tactile Switch, FSMJ Series, Top Actuated, Through Hole, Round Button, 160 gf, 50mA at 24VDC; Supplier 1: Digi-Key; Manufacturer: ALCOSWITCH - TE CONNECTIVITY; Manufacturer Part Number: 1825910-6; Stock 1: 10691; Pricing 1: 1=0.1, 10=0.101, 25=0.0956, 100=0.087, 250=0.0818, 500=0.0748, 1000=0.0627, 2500=0.0609, 5000=0.0574 (USD); Supplier Part Number 1: 450-1650-ND
U1-U4 = SN74AHC1G09DBVR: TEXAS INSTRUMENTS - SN74AHC1G09DBVR - AND Gate, 74AHC1G09, 2 Input, 2 V to 5.5 V, SOT-23-5; Number of Circuits: 1; Number of Inputs: 2; Voltage - Supply: 2 V ~ 5.5 V; Current - Quiescent (Max): 1µA; Current - Output High, Low: -, 8mA; Logic Level - Low: 0.5 V ~ 1.65 V; Logic Level - High: 1.5 V ~ 3.85 V; Max Propagation Delay @ V, Max CL: 7.5ns @ 5V, 50pF; Dynamic Catalog: 74AHC; Other Names: 296-29202-6; Supplier 1: Digi-Key; Manufacturer: Texas Instruments; Manufacturer Part Number: SN74AHC1G09DBVR; Stock 1: 19126; Pricing 1: 1=0.32, 10=0.24, 25=0.21, 100=0.1359, 250=0.1125, 500=0.09, 1000=0.069 (USD); Standard Package: 1; Category: Integrated Circuits (ICs); Family: Logic - Gates and Inverters; Series: 74AHC; Logic Type: AND Gate; Features: Open Drain; Operating Temperature: -55°C ~ 125°C; Mounting Type: Surface Mount; Supplier Device Package: SOT-23-5; Package / Case: SC-74A, SOT-753; Packaging: Digi-Reel®; ComponentLink1URL: http://www.ti.com/lit/ds/symlink/sn74ahc1g09.pdf?src-supplier=Digi-Key; ComponentLink1Description: http://www.ti.com/lit/ds/symlink/sn74ahc1g09.pdf?src-supplier=Digi-Key; Supplier Part Number 1: 296-29202-1-ND
U5 = ATMEGA328P-PU: ATMEGA328P-PU; 8 bit Microcontroller AVR 20MHz 1; 32kb Flash; 2kb RAM; I2C SPI 2; Manufacturer: Microchip / Atmel; Manuf. Code: ATM; Series (embedded microcontroller): AVR® ATmega; Core size: 8-Bit; Oscillator type: Internal; Peripherals: Brown-out Detect/Reset, POR, PWM, WDT; I/O number: 23; Supply voltage (max.): 5.5 V; Supply voltage (min.): 1.8 V; Data converter (embedded microcontroller): A/D 6x10b; EEPROM size: 1 K x 8; Connectivity: I²C, SPI, UART/USART; Program memory size: 32 KB (16 K x 16); RAM size: 2 K x 8; Casing: PDIP 28; Supplier 1: Digi-Key; Manufacturer Part Number: ATMEGA328P-PU; Stock 1: 1556; Pricing 1: 1=2.08, 25=1.91, 100=1.73 (USD); Type: ATMEGA328P-PU; Clock speed: 20 MHz; Processor core: AVR; Program memory type: FLASH; Max. operating temperature: +85 °C; Operating temperature (min.): -40 °C; ComponentLink1URL: http://www.farnell.com/datasheets/2047852.pdf?src-supplier=Element14; ComponentLink1Description: http://www.farnell.com/datasheets/2047852.pdf?src-supplier=Element14; ComponentLink2URL: http://www.rapidonline.com/pdf/73-4283.pdf?src-supplier=Rapid+Electronics; ComponentLink2Description: http://www.rapidonline.com/pdf/73-4283.pdf?src-supplier=Rapid+Electronics; ComponentLink3URL: http://www.microchip.com/mymicrochip/filehandler.aspx?ddocname=en589968&src-supplier=Verical; ComponentLink3Description: http://www.microchip.com/mymicrochip/filehandler.aspx?ddocname=en589968&src-supplier=Verical; ComponentLink4URL: http://www.microchip.com/mymicrochip/filehandler.aspx?ddocname=en589968&src-supplier=Jameco; ComponentLink4Description: http://www.microchip.com/mymicrochip/filehandler.aspx?ddocname=en589968&src-supplier=Jameco; ComponentLink5URL: http://datasheet.iiic.cc/atmel/ATMEGA328P-PU.pdf?src-supplier=IIIC; ComponentLink5Description: http://datasheet.iiic.cc/atmel/ATMEGA328P-PU.pdf?src-supplier=IIIC; ComponentLink6URL: http://www.produktinfo.conrad.com/datenblaetter/150000-174999/155197-da-01-en-MICROCONTR_ATMEGA328P_PU_8BIT_PDIP_28.pdf?src-supplier=Conrad; ComponentLink6Description: http://www.produktinfo.conrad.com/datenblaetter/150000-174999/155197-da-01-en-MICROCONTR_ATMEGA328P_PU_8BIT_PDIP_28.pdf?src-supplier=Conrad; Supplier Part Number 1: ATMEGA328P-PU-ND
U6 = TL1963A-33DCQT: Single Output LDO, 1.5A, 3.3V Fast Trans; Manufacturer: Texas Instruments; EDA / CAD Models: Download from Accelerated Designs; Regulator Topology: Positive Fixed; Voltage - Dropout (Typical): 0.34V @ 1.5A; Number of Regulators: 1; Voltage - Input: Up to 20V; Current - Limit (Min): 1.6A; Online Catalog: 3.1V to 3.3V; Other Names: 296-32342-2 TL1963A-33DCQT-ND TL1963A33DCQT; Supplier 1: Digi-Key; Manufacturer Part Number: TL1963A-33DCQT; Stock 1: 288; Pricing 1: 1=3.15, 10=2.827, 25=2.6732, 100=2.1978 (USD); Standard Package: 250; Category: Integrated Circuits (ICs); Family: PMIC - Voltage Regulators - Linear; Series: -; Packaging: Tape & Reel (TR); Voltage - Output: 3.3V; Current - Output: 1.5A; Operating Temperature: -40°C ~ 125°C; Mounting Type: Surface Mount; Package / Case: SOT-223-6; Supplier Device Package: SOT-223-6; ComponentLink1URL: http://www.ti.com/general/docs/lit/getliterature.tsp?genericPartNumber=TL1963A-18&&fileType=pdf&src-supplier=Avnet; ComponentLink1Description: http://www.ti.com/general/docs/lit/getliterature.tsp?genericPartNumber=TL1963A-18&&fileType=pdf&src-supplier=Avnet; ComponentLink2URL: http://www.ti.com/lit/ds/symlink/tl1963a.pdf?src-supplier=Digi-Key; ComponentLink2Description: http://www.ti.com/lit/ds/symlink/tl1963a.pdf?src-supplier=Digi-Key; ComponentLink3URL: http://focus.ti.com/lit/ds/symlink/tl1963a-25.pdf?src-supplier=Avnet+Europe; ComponentLink3Description: http://focus.ti.com/lit/ds/symlink/tl1963a-25.pdf?src-supplier=Avnet+Europe; Supplier Part Number 1: 296-32342-1-ND
U7 = ATMEGA16U2-AU: MICROCHIP - ATMEGA16U2-AU - MCU, 8BIT, MEGAAVR, 16MHZ, TQFP-32; Manufacturer: Microchip / Atmel; MCU Applications: USB Microcontroller; Program Memory Size: 16KB; RAM Memory Size: 512Byte; No. of I/O's: 22I/O's; MCU Case Style: TQFP; No. of Pins: 32Pins; Embedded Interface Type: QSPI, UART, USB; Supply Voltage Min: 2.7V; Supply Voltage Max: 5.5V; SVHC: No SVHC (15-Jun-2015); Supplier 1: Digi-Key; Manufacturer Part Number: ATMEGA16U2-AU; Stock 1: 1546; Pricing 1: 1=2.45, 25=2.25, 100=2.04 (USD); Architecture: megaAVR; MCU Core Size: 8bit; CPU Speed: 16MHz; Packaging: Each; MSL: MSL 3 - 168 hours; ComponentLink1URL: http://www.microchip.com/mymicrochip/filehandler.aspx?ddocname=en590463&src-supplier=Mouser; ComponentLink1Description: http://www.microchip.com/mymicrochip/filehandler.aspx?ddocname=en590463&src-supplier=Mouser; ComponentLink2URL: http://www.atmel.com/dyn/resources/prod_documents/doc7799.pdf?src-supplier=Farnell; ComponentLink2Description: http://www.atmel.com/dyn/resources/prod_documents/doc7799.pdf?src-supplier=Farnell; Supplier Part Number 1: ATMEGA16U2-AU-ND